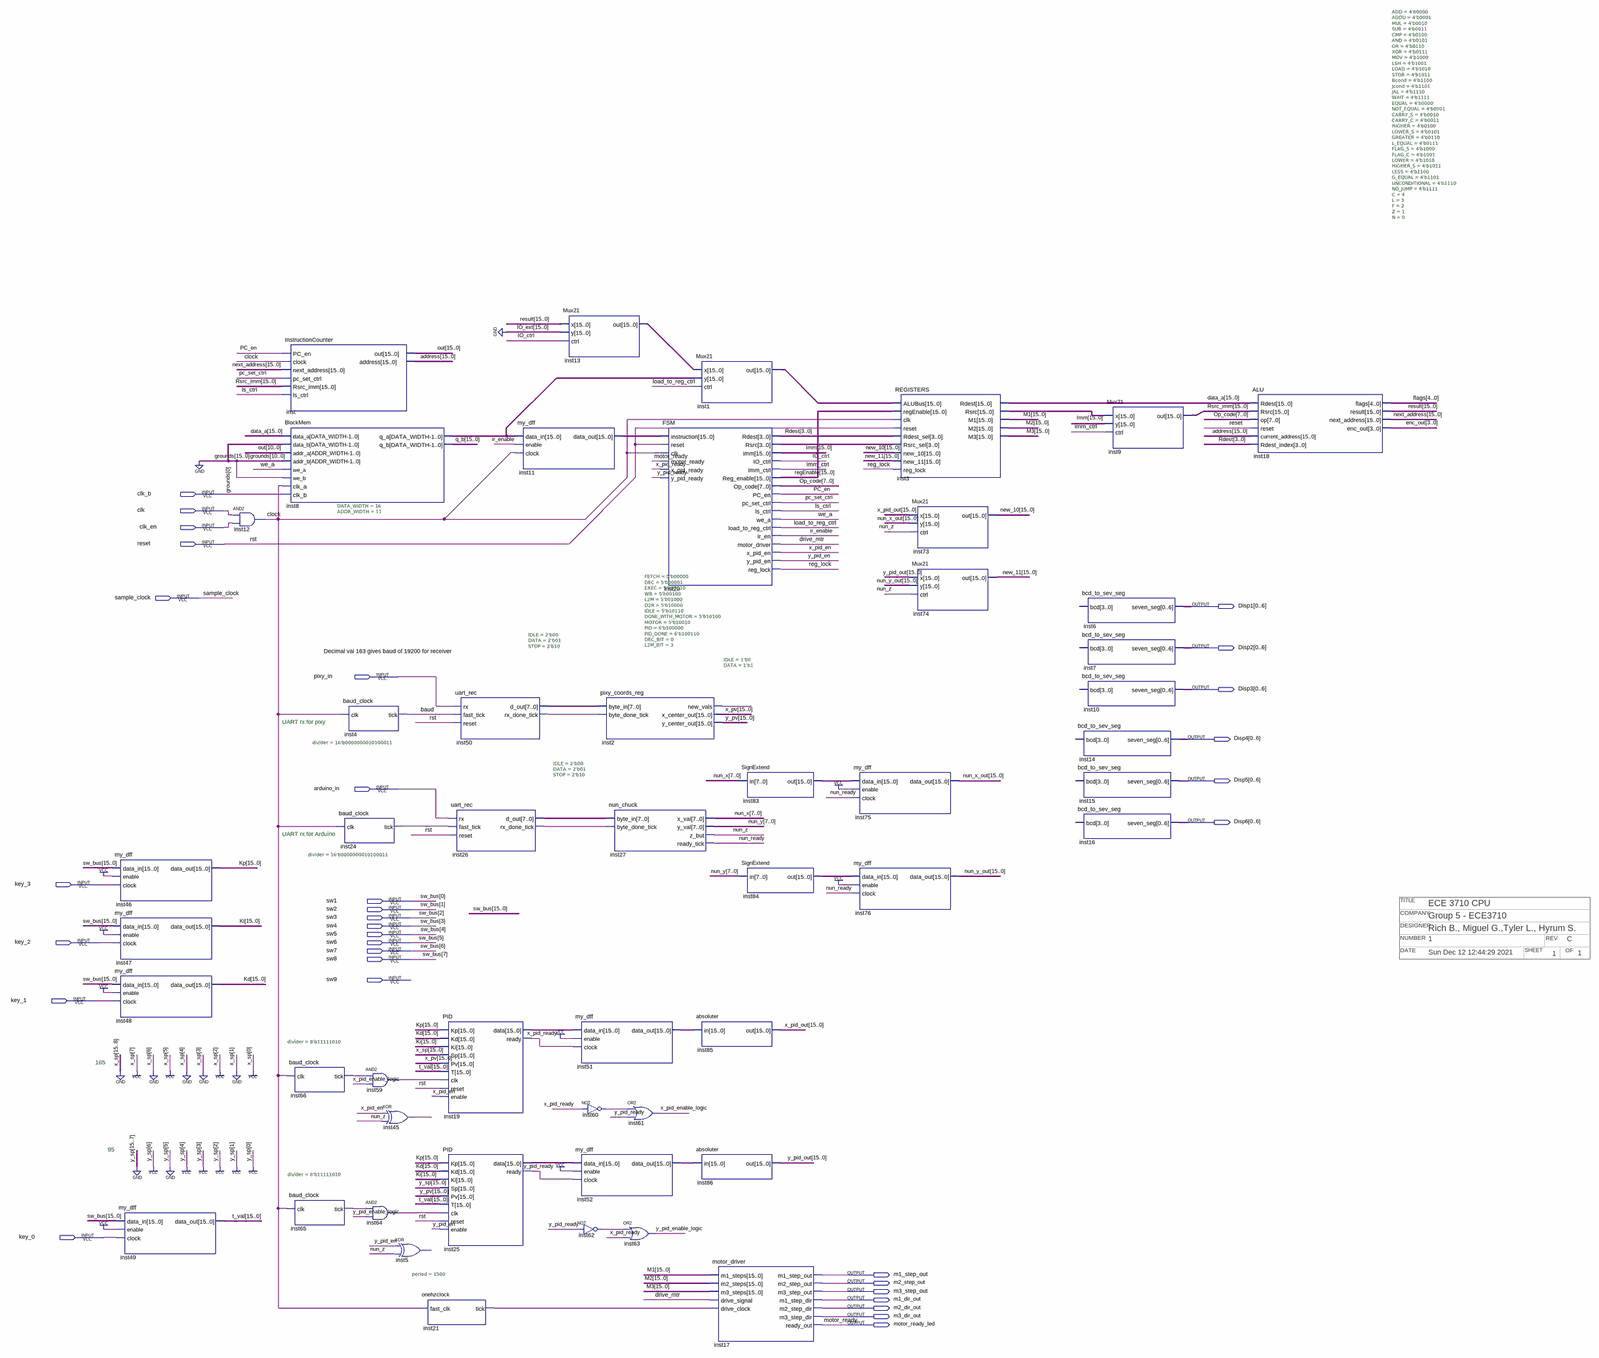
[diagram p0: schematic sheet, whole]
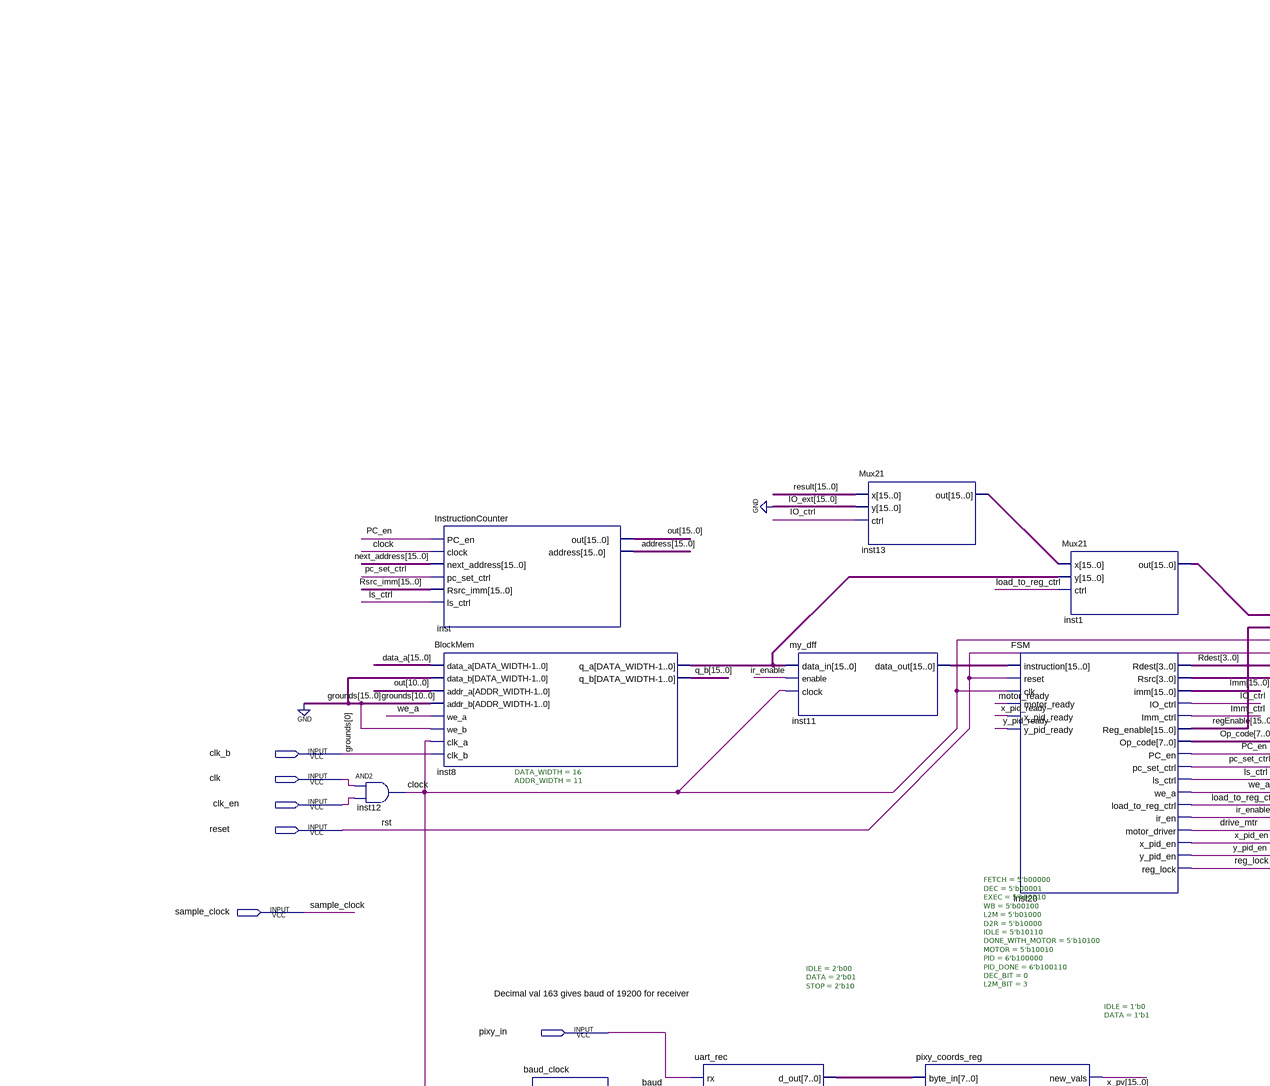
[diagram p1: schematic sheet, upper left part]
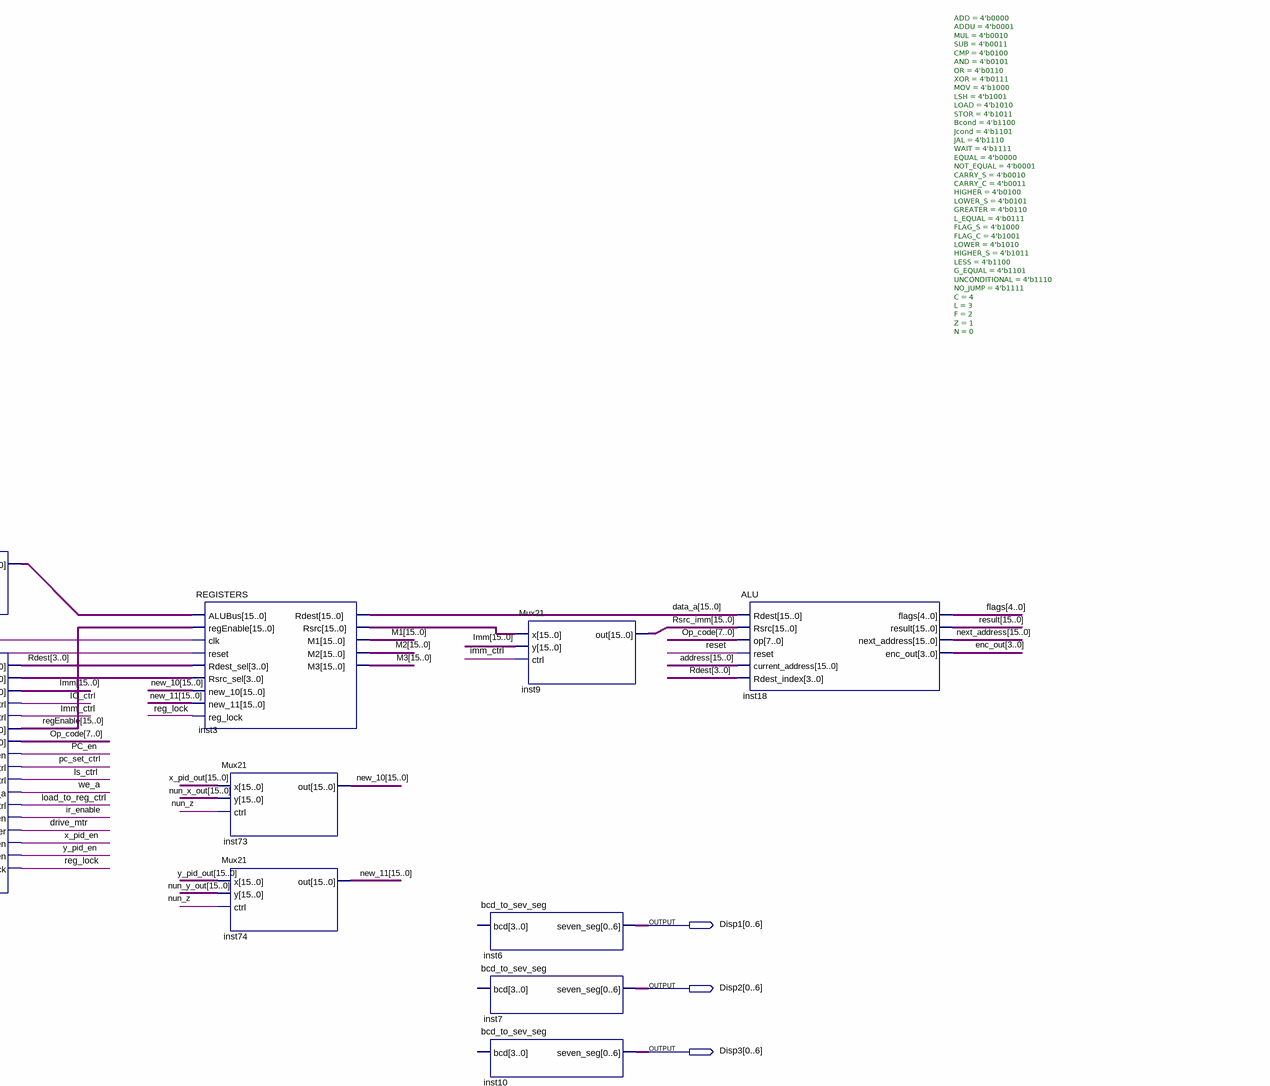
[diagram p2: schematic sheet, upper right part]
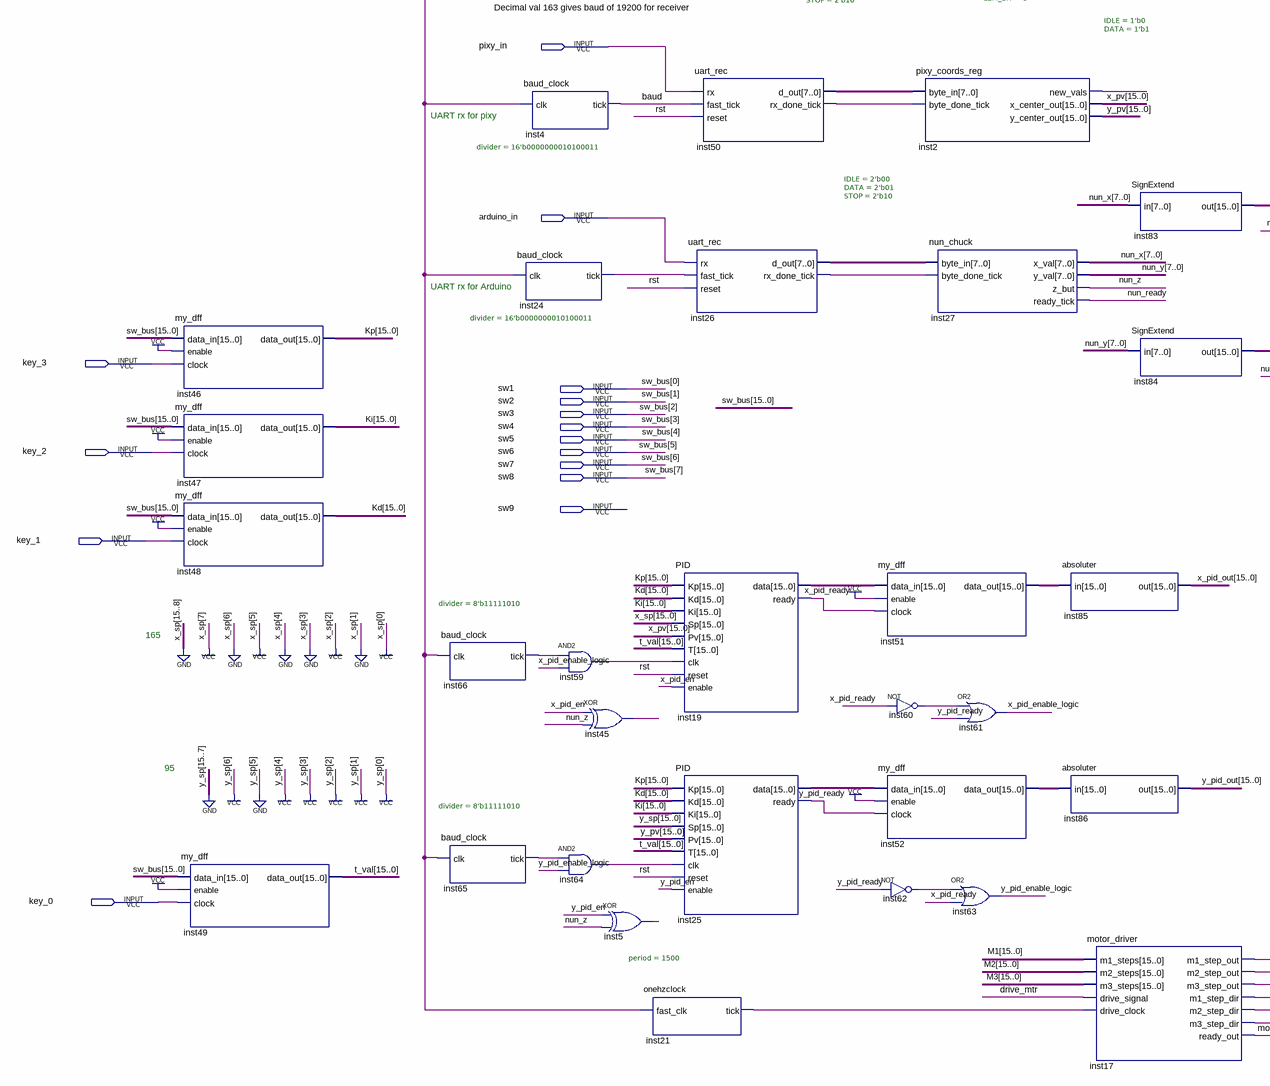
[diagram p3: schematic sheet, lower left part]
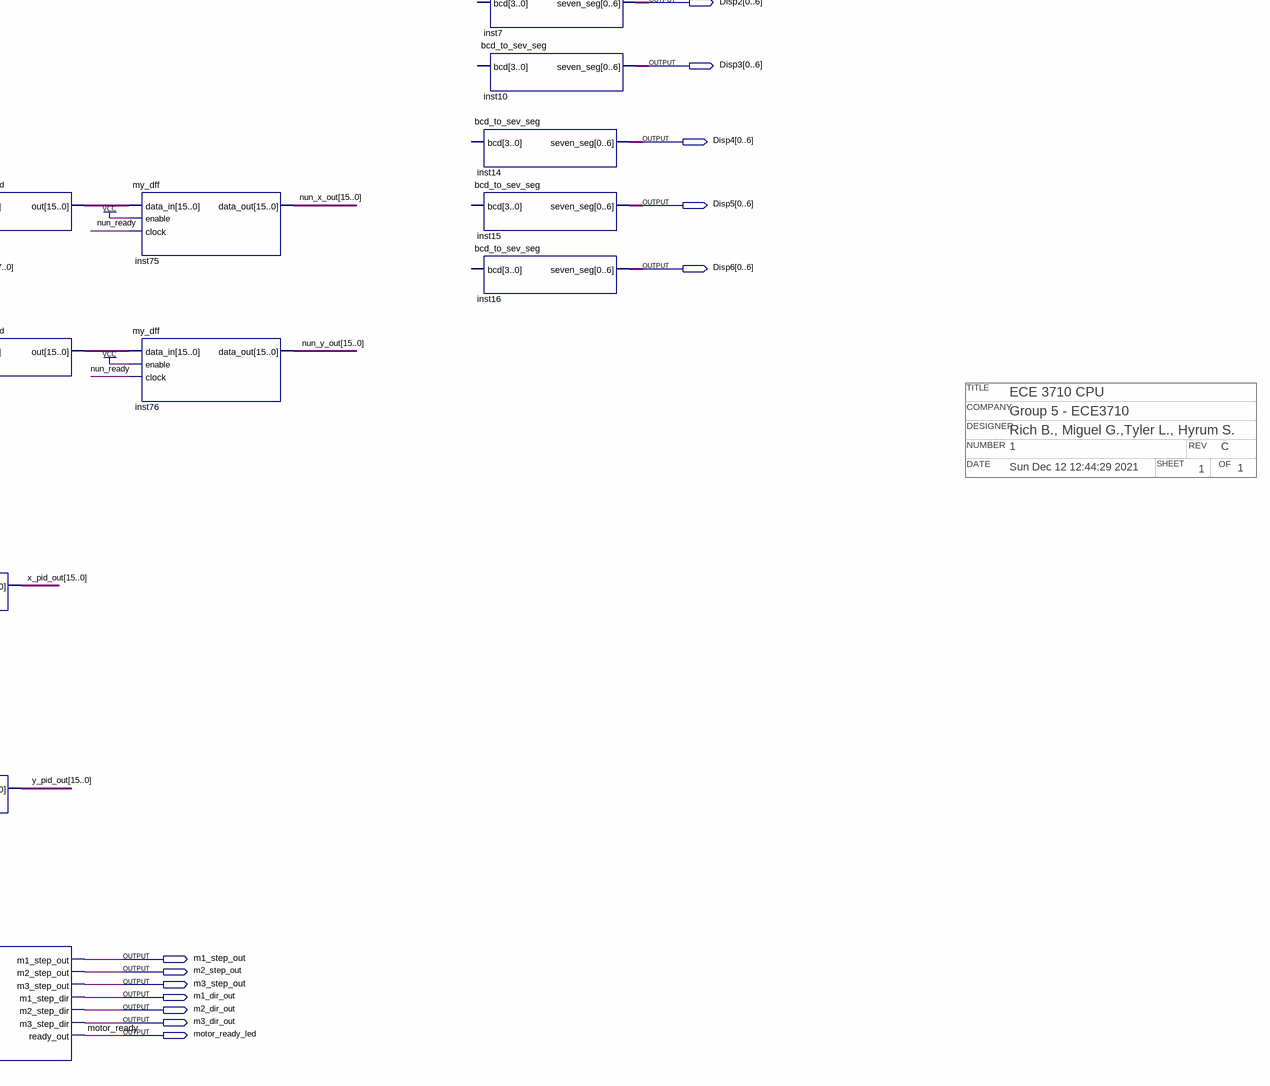
[diagram p4: schematic sheet, lower right part]
// Quartus schematic CPU_ForDiagram.bdf as structural Verilog: 50 symbols, 33 pins
// Title block: COMPANY: Group 5 - ECE3710; DATE: Sun Dec 12 12:44:29 2021; DESIGNER: Rich B., Miguel G.,Tyler L., Hyrum S.; NUMBER: 1; OF: 1; REV: C; SHEET: 1; TITLE: ECE 3710 CPU
module CPU_ForDiagram (
  input  clk_b,
  input  clk,
  input  clk_en,
  input  reset,
  input  sample_clock,
  input  pixy_in,
  input  arduino_in,
  input  key_3,
  input  sw1,
  input  sw2,
  input  sw3,
  input  sw4,
  input  sw5,
  input  key_2,
  input  sw6,
  input  sw7,
  input  sw8,
  input  sw9,
  input  key_1,
  input  key_0,
  output [0:6] Disp1,
  output [0:6] Disp2,
  output [0:6] Disp3,
  output [0:6] Disp4,
  output [0:6] Disp5,
  output [0:6] Disp6,
  output m1_step_out,
  output m2_step_out,
  output m3_step_out,
  output m1_dir_out,
  output m2_dir_out,
  output m3_dir_out,
  output motor_ready_led
);

  wire baud, clock, drive_mtr, imm_ctrl, inst2_new_vals, inst5_out, inst21_tick, inst24_tick,
       inst26_rx_done_tick, inst45_out, inst50_rx_done_tick, inst59_out, inst60_out, inst62_out, inst64_out,
       inst65_tick, inst66_tick, IO_ctrl, ir_enable, load_to_reg_ctrl, ls_ctrl, nun_ready, nun_z, PC_en,
       pc_set_ctrl, reg_lock, we_a, x_pid_en, x_pid_enable_logic, x_pid_ready, y_pid_en, y_pid_enable_logic,
       y_pid_ready;
  wire [3:0] enc_out, inst20_rsrc, Rdest;
  wire [4:0] flags;
  wire [7:0] inst26_d_out, inst50_d_out, nun_x, nun_y, Op_code;
  wire [15:0] address, data_a, Imm, inst1_out, inst3_rsrc, inst8_q_a, inst11_data_out, inst13_out,
       inst19_data, inst25_data, inst51_data_out, inst52_data_out, inst83_out, inst84_out, Kd, Ki, Kp, M1,
       M2, M3, new_10, new_11, next_address, nun_x_out, nun_y_out, out, q_b, regEnable, result, Rsrc_imm,
       t_val, x_pid_out, x_pv, y_pid_out, y_pv;
  wire [15:8] sw_bus;

  my_dff inst46 (
    .data_in({sw_bus, sw8, sw7, sw6, sw5, sw4, sw3, sw2, sw1}), .enable(1'b1), .clock(key_3), .data_out(Kp));
  my_dff inst47 (
    .data_in({sw_bus, sw8, sw7, sw6, sw5, sw4, sw3, sw2, sw1}), .enable(1'b1), .clock(key_2), .data_out(Ki));
  my_dff inst48 (
    .data_in({sw_bus, sw8, sw7, sw6, sw5, sw4, sw3, sw2, sw1}), .enable(1'b1), .clock(key_1), .data_out(Kd));
  my_dff inst49 (
    .data_in({sw_bus, sw8, sw7, sw6, sw5, sw4, sw3, sw2, sw1}), .enable(1'b1), .clock(key_0), .data_out(t_val));
  and inst12 (clock, clk, clk_en);
  InstructionCounter inst (
    .PC_en(PC_en), .clock(clock), .next_address(next_address), .pc_set_ctrl(pc_set_ctrl),
    .Rsrc_imm(Rsrc_imm), .ls_ctrl(ls_ctrl), .out(out), .address(address));
  BlockMem #(.DATA_WIDTH(16), .ADDR_WIDTH(11)) inst8 (
    .data_a(data_a), .data_b({16{1'b0}}), .addr_a(out[10:0]), .addr_b({11{1'b0}}), .we_a(we_a), .we_b(1'b0),
    .clk_a(clock), .clk_b(clk_b), .q_a(inst8_q_a), .q_b(q_b));
  baud_clock #(.divider(8'b11111010)) inst66 (.clk(clock), .tick(inst66_tick));
  baud_clock #(.divider(8'b11111010)) inst65 (.clk(clock), .tick(inst65_tick));
  baud_clock #(.divider(16'b0000000010100011)) inst4 (.clk(clock), .tick(baud));
  baud_clock #(.divider(16'b0000000010100011)) inst24 (.clk(clock), .tick(inst24_tick));
  and inst59 (inst59_out, inst66_tick, x_pid_enable_logic);
  and inst64 (inst64_out, inst65_tick, y_pid_enable_logic);
  xor inst45 (inst45_out, x_pid_en, nun_z);
  xor inst5 (inst5_out, y_pid_en, nun_z);
  PID inst19 (
    .Kp(Kp), .Kd(Kd), .Ki(Ki), .Sp(16'b0000000010100101), .Pv(x_pv), .T(t_val), .clk(inst59_out),
    .reset(reset), .enable(x_pid_en), .data(inst19_data), .ready(x_pid_ready));
  PID inst25 (
    .Kp(Kp), .Kd(Kd), .Ki(Ki), .Sp(16'b0000000001011111), .Pv(y_pv), .T(t_val), .clk(inst64_out),
    .reset(reset), .enable(y_pid_en), .data(inst25_data), .ready(y_pid_ready));
  onehzclock #(.period(1500)) inst21 (.fast_clk(clock), .tick(inst21_tick));
  uart_rec #(.IDLE(2'b00), .DATA(2'b01), .STOP(2'b10)) inst50 (
    .rx(pixy_in), .fast_tick(baud), .reset(reset), .d_out(inst50_d_out), .rx_done_tick(inst50_rx_done_tick));
  uart_rec #(.IDLE(2'b00), .DATA(2'b01), .STOP(2'b10)) inst26 (
    .rx(arduino_in), .fast_tick(inst24_tick), .reset(reset), .d_out(inst26_d_out),
    .rx_done_tick(inst26_rx_done_tick));
  my_dff inst11 (.data_in(inst8_q_a), .enable(ir_enable), .clock(clock), .data_out(inst11_data_out));
  Mux21 inst13 (.x(result), .y({16{1'b0}}), .ctrl(IO_ctrl), .out(inst13_out));
  my_dff inst51 (.data_in(inst19_data), .enable(1'b1), .clock(x_pid_ready), .data_out(inst51_data_out));
  my_dff inst52 (.data_in(inst25_data), .enable(1'b1), .clock(y_pid_ready), .data_out(inst52_data_out));
  pixy_coords_reg #(.IDLE(1'b0), .DATA(1'b1)) inst2 (
    .byte_in(inst50_d_out), .byte_done_tick(inst50_rx_done_tick), .new_vals(inst2_new_vals),
    .x_center_out(x_pv), .y_center_out(y_pv));
  nun_chuck inst27 (
    .byte_in(inst26_d_out), .byte_done_tick(inst26_rx_done_tick), .x_val(nun_x), .y_val(nun_y),
    .z_but(nun_z), .ready_tick(nun_ready));
  not inst60 (inst60_out, x_pid_ready);
  not inst62 (inst62_out, y_pid_ready);
  or inst61 (x_pid_enable_logic, inst60_out, y_pid_ready);
  or inst63 (y_pid_enable_logic, inst62_out, x_pid_ready);
  FSM #(.FETCH(5'b00000), .DEC(5'b00001), .EXEC(5'b00010), .WB(5'b00100), .L2M(5'b01000), .D2R(5'b10000), .IDLE(5'b10110), .DONE_WITH_MOTOR(5'b10100), .MOTOR(5'b10010), .PID(6'b100000), .PID_DONE(6'b100110), .DEC_BIT(0), .L2M_BIT(3)) inst20 (
    .instruction(inst11_data_out), .reset(reset), .clk(clock), .motor_ready(motor_ready_led),
    .x_pid_ready(x_pid_ready), .y_pid_ready(y_pid_ready), .Rdest(Rdest), .Rsrc(inst20_rsrc), .imm(Imm),
    .IO_ctrl(IO_ctrl), .Imm_ctrl(imm_ctrl), .Reg_enable(regEnable), .Op_code(Op_code), .PC_en(PC_en),
    .pc_set_ctrl(pc_set_ctrl), .ls_ctrl(ls_ctrl), .we_a(we_a), .load_to_reg_ctrl(load_to_reg_ctrl),
    .ir_en(ir_enable), .motor_driver(drive_mtr), .x_pid_en(x_pid_en), .y_pid_en(y_pid_en), .reg_lock(reg_lock));
  Mux21 inst1 (.x(inst13_out), .y(inst8_q_a), .ctrl(load_to_reg_ctrl), .out(inst1_out));
  absoluter inst85 (.in(inst51_data_out), .out(x_pid_out));
  absoluter inst86 (.in(inst52_data_out), .out(y_pid_out));
  SignExtend inst83 (.in(nun_x), .out(inst83_out));
  SignExtend inst84 (.in(nun_y), .out(inst84_out));
  motor_driver inst17 (
    .m1_steps(M1), .m2_steps(M2), .m3_steps(M3), .drive_signal(drive_mtr), .drive_clock(inst21_tick),
    .m1_step_out(m1_step_out), .m2_step_out(m2_step_out), .m3_step_out(m3_step_out),
    .m1_step_dir(m1_dir_out), .m2_step_dir(m2_dir_out), .m3_step_dir(m3_dir_out), .ready_out(motor_ready_led));
  my_dff inst75 (.data_in(inst83_out), .enable(1'b1), .clock(nun_ready), .data_out(nun_x_out));
  my_dff inst76 (.data_in(inst84_out), .enable(1'b1), .clock(nun_ready), .data_out(nun_y_out));
  REGISTERS inst3 (
    .ALUBus(inst1_out), .regEnable(regEnable), .clk(clock), .reset(reset), .new_10(new_10), .new_11(new_11),
    .reg_lock(reg_lock), .Rdest_sel(Rdest), .Rsrc_sel(inst20_rsrc), .M1(M1), .M2(M2), .M3(M3),
    .Rdest(data_a), .Rsrc(inst3_rsrc));
  Mux21 inst73 (.x(x_pid_out), .y(nun_x_out), .ctrl(nun_z), .out(new_10));
  Mux21 inst74 (.x(y_pid_out), .y(nun_y_out), .ctrl(nun_z), .out(new_11));
  Mux21 inst9 (.x(inst3_rsrc), .y(Imm), .ctrl(imm_ctrl), .out(Rsrc_imm));
  bcd_to_sev_seg inst6 (.seven_seg(Disp1));  // open: bcd
  bcd_to_sev_seg inst7 (.seven_seg(Disp2));  // open: bcd
  bcd_to_sev_seg inst10 (.seven_seg(Disp3));  // open: bcd
  bcd_to_sev_seg inst14 (.seven_seg(Disp4));  // open: bcd
  bcd_to_sev_seg inst15 (.seven_seg(Disp5));  // open: bcd
  bcd_to_sev_seg inst16 (.seven_seg(Disp6));  // open: bcd
  ALU #(.ADD(4'b0000), .ADDU(4'b0001), .MUL(4'b0010), .SUB(4'b0011), .CMP(4'b0100), .AND(4'b0101), .OR(4'b0110), .XOR(4'b0111), .MOV(4'b1000), .LSH(4'b1001), .LOAD(4'b1010), .STOR(4'b1011), .Bcond(4'b1100), .Jcond(4'b1101), .JAL(4'b1110), .WAIT(4'b1111), .EQUAL(4'b0000), .NOT_EQUAL(4'b0001), .CARRY_S(4'b0010), .CARRY_C(4'b0011), .HIGHER(4'b0100), .LOWER_S(4'b0101), .GREATER(4'b0110), .L_EQUAL(4'b0111), .FLAG_S(4'b1000), .FLAG_C(4'b1001), .LOWER(4'b1010), .HIGHER_S(4'b1011), .LESS(4'b1100), .G_EQUAL(4'b1101), .UNCONDITIONAL(4'b1110), .NO_JUMP(4'b1111), .C(4), .L(3), .F(2), .Z(1), .N(0)) inst18 (
    .Rdest(data_a), .Rsrc(Rsrc_imm), .op(Op_code), .reset(reset), .current_address(address),
    .Rdest_index(Rdest), .flags(flags), .result(result), .next_address(next_address), .enc_out(enc_out));

  // Other names for the same wires on the sheet: motor_ready = motor_ready_led; rst = reset;
  //   sw_bus[7:0] = {sw8, sw7, sw6, sw5, sw4, sw3, sw2, sw1}

  // Notes on the sheet:
  //   Decimal val 163 gives baud of 19200 for receiver
  //   UART rx for pixy
  //   UART rx for Arduino
  //   165
  //   95
endmodule
